# Altium project stm32.PrjPcb
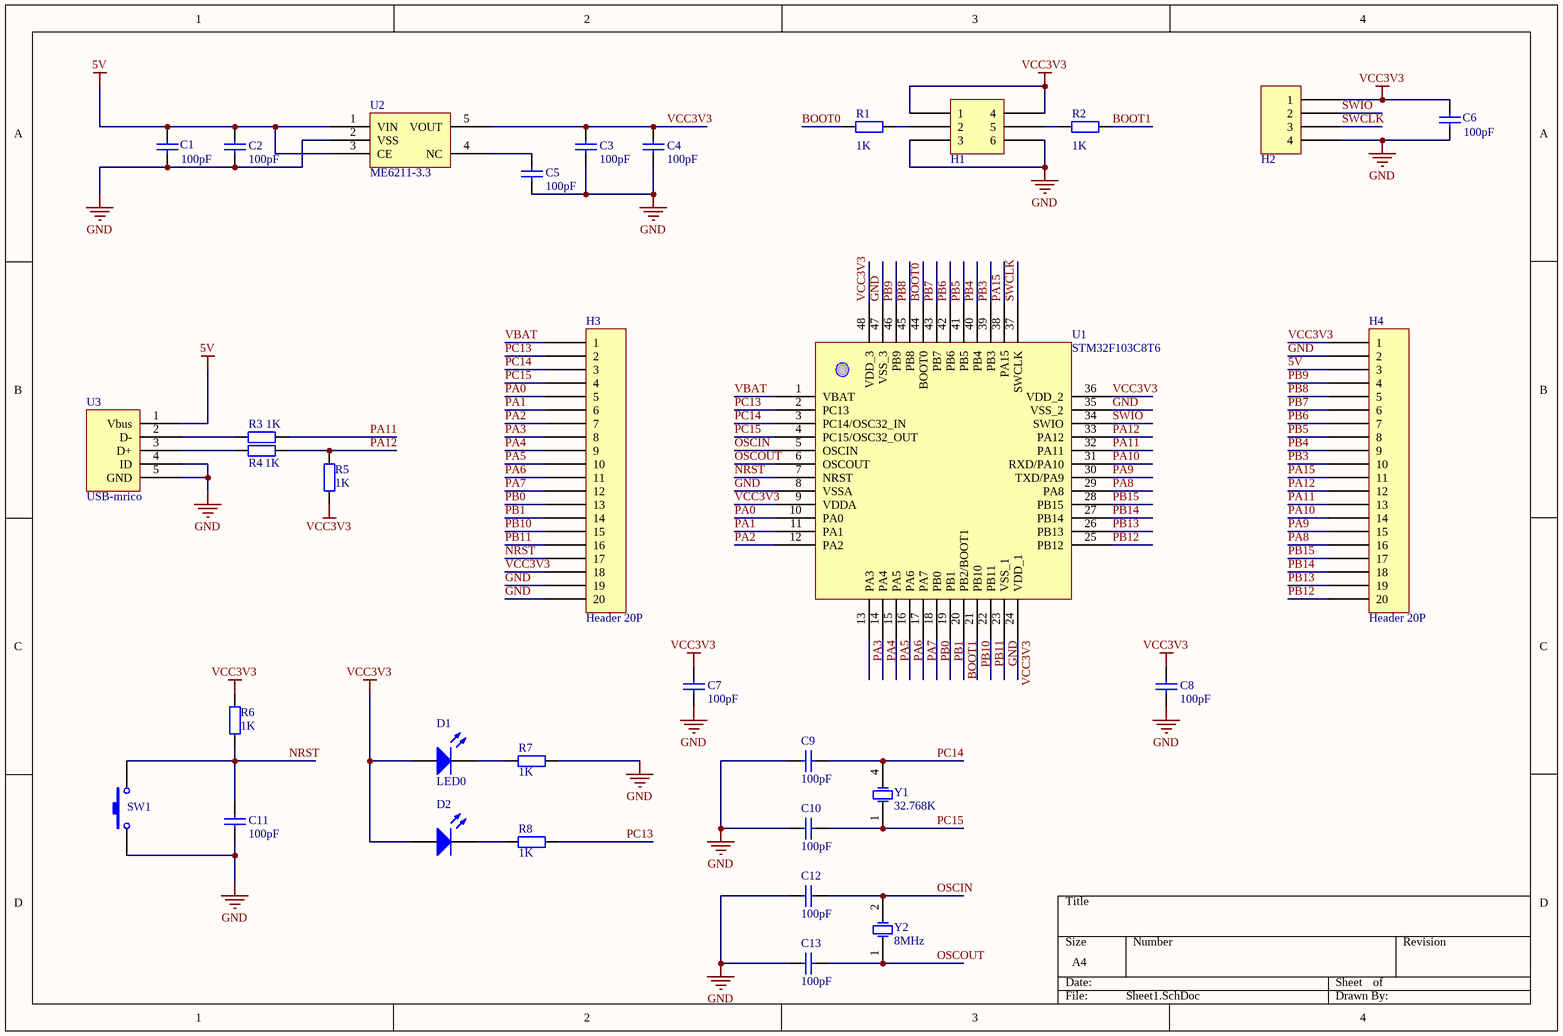
[diagram p0: Sheet1.SchDoc]
1 sheet, 33 parts. Net scope: global (net labels, ports and power ports of the same name join across sheets).
Board file: PCB1.PcbDoc

## Sheet Sheet1.SchDoc
size A4

### Parts
C1  value 100pF  [C 0603_L]  (hidden comment: Cap)
C2  value 100pF  [C 0603_L]  (hidden comment: Cap)
C3  value 100pF  [C 0603_L]  (hidden comment: Cap)
C4  value 100pF  [C 0603_L]  (hidden comment: Cap)
C5  value 100pF  [C 0805_L]  (hidden comment: Cap)
C6  value 100pF  [C 0805_L]  (hidden comment: Cap)
C7  value 100pF  [C 0603_L]  (hidden comment: Cap)
C8  value 100pF  [C 0603_L]  (hidden comment: Cap)
C9  value 100pF  [C 0603_L]  (hidden comment: Cap)
C10  value 100pF  [C 0603_L]  (hidden comment: Cap)
C11  value 100pF  [C 0603_L]  (hidden comment: Cap)
C12  value 100pF  [C 0603_L]  (hidden comment: Cap)
C13  value 100pF  [C 0603_L]  (hidden comment: Cap)
D1  LED0  [LED 0603W]
D2  LED0  [LED 0603W]  (value not drawn)
H1  HEADER 6P  [HDR2.54-LI-2x3P]  (value not drawn)
H2  HEADER 4P  [HDR2.54-LI-4P]  (value not drawn)
H3  Header 20P  [HDR2.54-LI-20P]
H4  Header 20P  [HDR2.54-LI-20P]
R1  value 1K  [R 0603_L]  (hidden comment: Res2)
R2  value 1K  [R 0603_L]  (hidden comment: Res2)
R3  value 1K  [R 0603_L]  (hidden comment: Res2)
R4  value 1K  [R 0603_L]  (hidden comment: Res2)
R5  value 1K  [R 0603_L]  (hidden comment: Res2)
R6  value 1K  [R 0603_L]  (hidden comment: Res2)
R7  value 1K  [R 0603_L]  (hidden comment: Res2)
R8  value 1K  [R 0603_L]  (hidden comment: Res2)
SW1  SW-PB  [TSW SMD-3*6*4.3]  (value not drawn)
U1  STM32F103C8T6  [LQFP48_N]
U2  ME6211-3.3  [SOT23-5]
U3  USB-mrico  [USB-MICRO_B]
Y1  32.768K  [OSC MC-306]
Y2  8MHz  [OSC HC-49S]

### Nets
5V: C1.2 C2.2 H4.3 U2.1(VIN) U2.3(CE) U3.1(Vbus)
GND: C1.1 C2.1 C3.1 C4.1 C5.1 C6.1 C7.1 C8.1 C9.2 C10.2 C11.1 C12.2 C13.2 H1.3 H1.6 H2.4 H3.19 H3.20 H4.2 R7.1 SW1.1 U1.8(VSSA) U1.23(VSS_1) U1.35(VSS_2) U1.47(VSS_3) U2.2(VSS) U3.4(ID) U3.5(GND)
VCC3V3: C3.2 C4.2 C6.2 C7.2 C8.2 D1.1(A) D2.1(A) H1.1 H1.4 H2.1 H3.18 H4.1 R5.1 R6.2 U1.9(VDDA) U1.24(VDD_1) U1.36(VDD_2) U1.48(VDD_3) U2.5(VOUT)
BOOT0: R1.1 U1.44(BOOT0)
BOOT1: R2.2 U1.20(PB2/BOOT1)
NRST: C11.2 H3.17 R6.1 SW1.2 U1.7(NRST)
OSCIN: C12.1 U1.5(OSCIN) Y2.2(OSC2)
OSCOUT: C13.1 U1.6(OSCOUT) Y2.1(OSC1)
PA0: H3.5 U1.10(PA0)
PA1: H3.6 U1.11(PA1)
PA2: H3.7 U1.12(PA2)
PA3: H3.8 U1.13(PA3)
PA4: H3.9 U1.14(PA4)
PA5: H3.10 U1.15(PA5)
PA6: H3.11 U1.16(PA6)
PA7: H3.12 U1.17(PA7)
PA8: H4.16 U1.29(PA8)
PA9: H4.15 U1.30(TXD/PA9)
PA10: H4.14 U1.31(RXD/PA10)
PA11: H4.13 R3.2 U1.32(PA11)
PA12: H4.12 R4.2 R5.2 U1.33(PA12)
PA15: H4.11 U1.38(PA15)
PB0: H3.13 U1.18(PB0)
PB1: H3.14 U1.19(PB1)
PB3: H4.10 U1.39(PB3)
PB4: H4.9 U1.40(PB4)
PB5: H4.8 U1.41(PB5)
PB6: H4.7 U1.42(PB6)
PB7: H4.6 U1.43(PB7)
PB8: H4.5 U1.45(PB8)
PB9: H4.4 U1.46(PB9)
PB10: H3.15 U1.21(PB10)
PB11: H3.16 U1.22(PB11)
PB12: H4.20 U1.25(PB12)
PB13: H4.19 U1.26(PB13)
PB14: H4.18 U1.27(PB14)
PB15: H4.17 U1.28(PB15)
PC13: H3.2 R8.1 U1.2(PC13)
PC14: C9.1 H3.3 U1.3(PC14/OSC32_IN) Y1.4(OSC4)
PC15: C10.1 H3.4 U1.4(PC15/OSC32_OUT) Y1.1(OSC1)
SWCLK: H2.3 U1.37(SWCLK)
SWIO: H2.2 U1.34(SWIO)
VBAT: H3.1 U1.1(VBAT)
NetC5_2: C5.2 U2.4(NC)
NetD1_2: D1.2(K) R7.2
NetD2_2: D2.2(K) R8.2
NetH1_2: H1.2 R1.2
NetH1_5: H1.5 R2.1
NetR3_1: R3.1 U3.2(D-)
NetR4_1: R4.1 U3.3(D+)

### Library data of the parts
C1-C13 = Cap: Capacitor; Published: 8-Jun-2000; LatestRevisionDate: 17-Jul-2002; LatestRevisionNote: Re-released for DXP Platform.; PackageReference: RAD-0.3; Publisher: Altium Limited; PackageDescription: Radial Cap, Thru-Hole; 2 Leads; 0.3 in Pin Spacing
D1 D2 = LED0: Typical INFRARED GaAs LED; Published: 8-Jun-2000; LatestRevisionDate: 08-Jul-2005; LatestRevisionNote: Mech Layer 1 removed.; PackageReference: LED-0; Publisher: Altium Limited; PackageDescription: LED; 2 Leads
R1-R8 = Res2: Resistor; Published: 8-Jun-2000; LatestRevisionDate: 17-Jul-2002; LatestRevisionNote: Re-released for DXP Platform.; PackageReference: AXIAL-0.4; Publisher: Altium Limited; PackageDescription: Axial Device, Thru-Hole; 2 Leads; 0.4 in Pin Spacing
SW1 = SW-PB: Switch; Published: 24-Mar-1999; LatestRevisionDate: 17-Jul-2002; LatestRevisionNote: Re-released for DXP Platform.; PackageReference: SPST-2; Publisher: Altium Limited; PackageDescription: Switch; 2 Leads
Y1 Y2 = XTAL: Crystal Oscillator; Published: 8-Jun-2000; LatestRevisionDate: 17-Jul-2002; LatestRevisionNote: Re-released for DXP Platform.; PackageReference: R38; Publisher: Altium Limited; PackageDescription: Crystal, Thru-Hole; 2 Leads; Body 3.1 x 8.2 mm (Dia.xH)